# EAGLE design Triggy 0.3 (EAGLE 7.4.0)
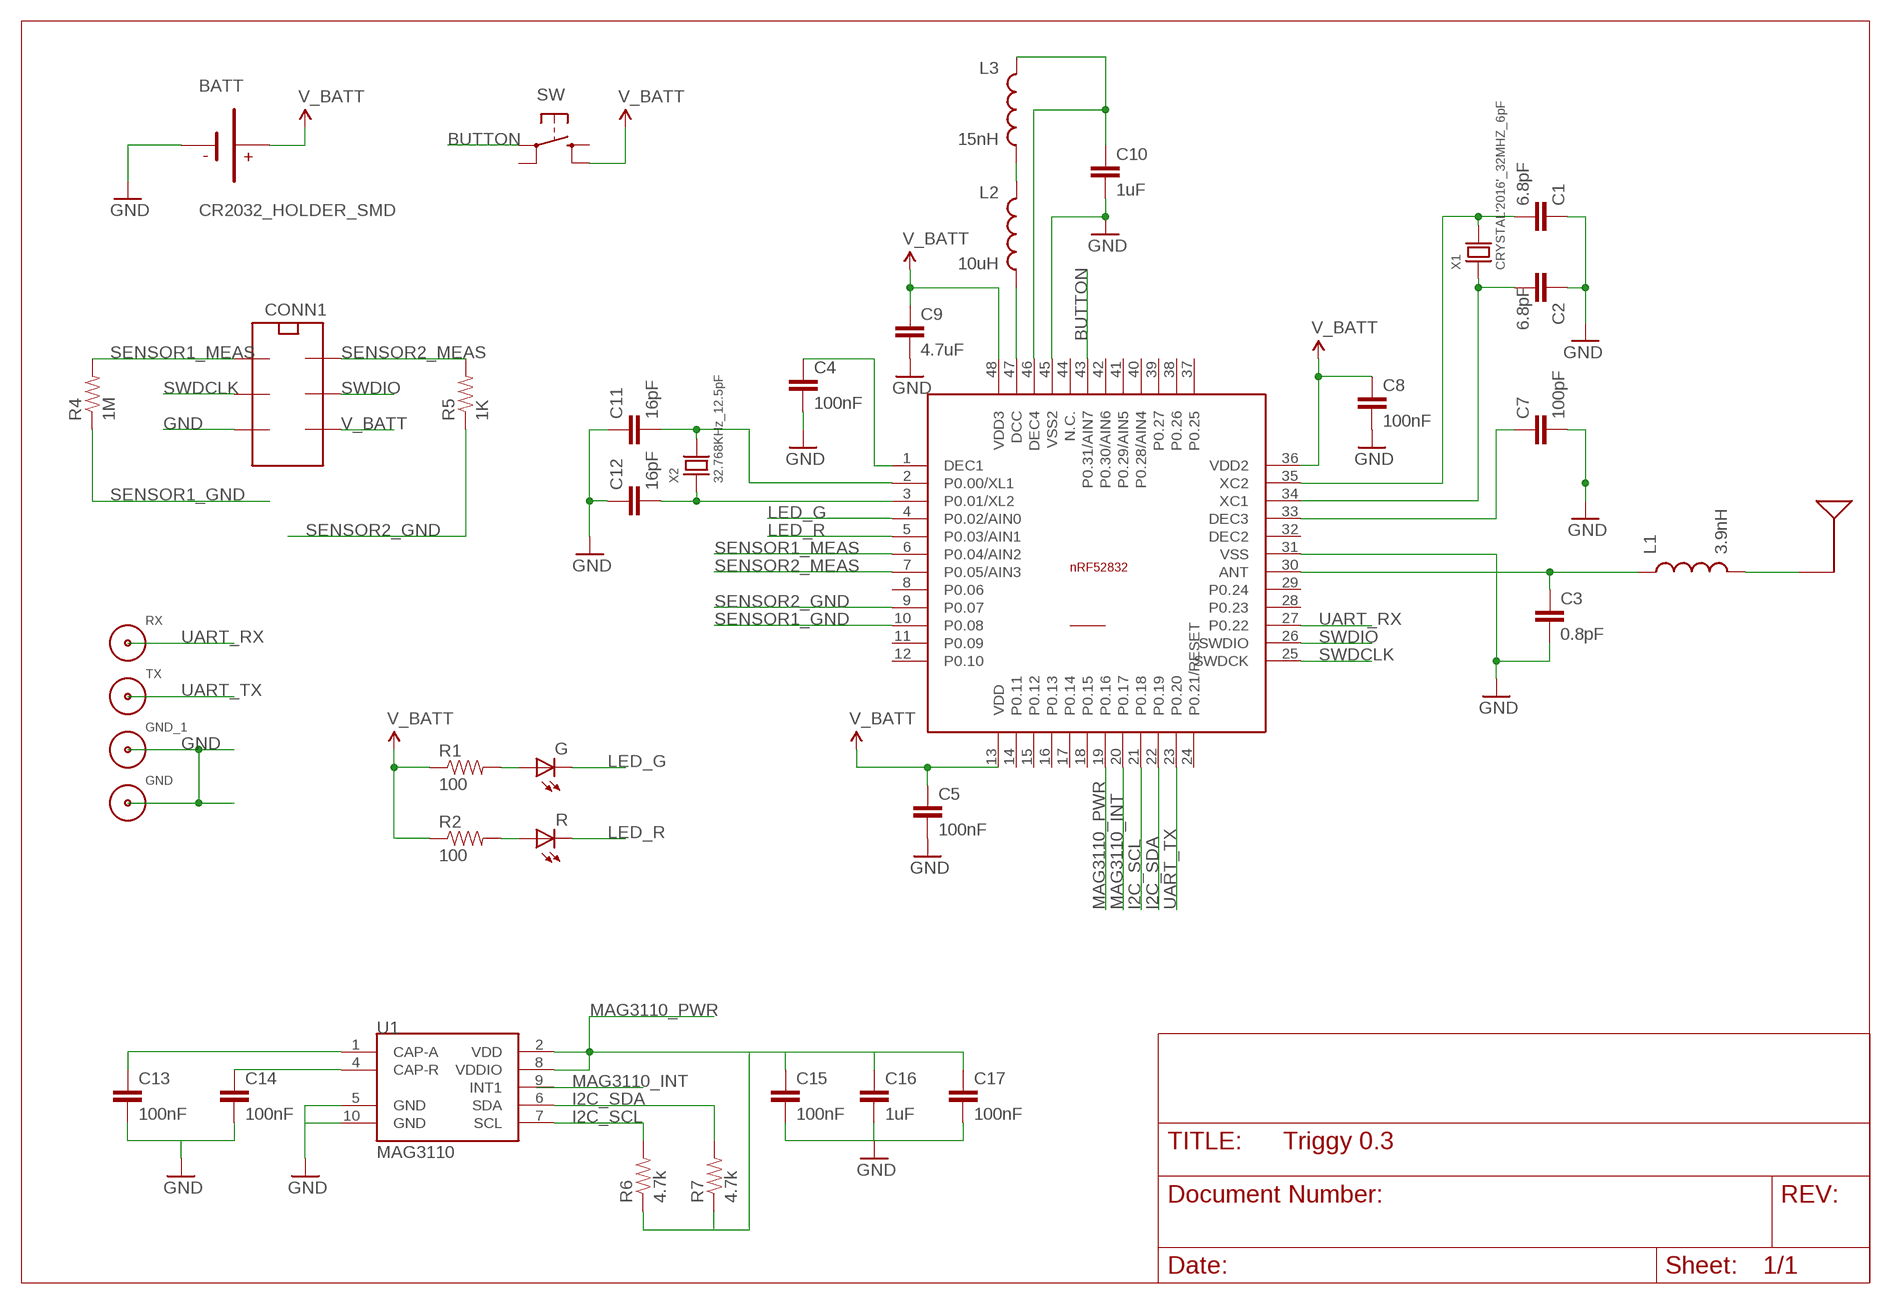
[diagram p0: schematic, sheet 1]

## Parts
ANT  ANTENNA_2450AT43A100  [ANTENNA-SMD-7MM]
BATT  CR2032_HOLDER_SMD  [CR2032_HOLDER_SMD]
C1  6.8pF  CAP0402-CAP  [0402-CAP]
C2  6.8pF  CAP0402-CAP  [0402-CAP]
C3  0.8pF  CAP0402-CAP  [0402-CAP]
C4  100nF  CAP0402-CAP  [0402-CAP]
C5  100nF  CAP0402-CAP  [0402-CAP]
C7  100pF  CAP0402-CAP  [0402-CAP]
C8  100nF  CAP0402-CAP  [0402-CAP]
C9  4.7uF  CAP0603-CAP  [0603-CAP]
C10  1uF  CAP0603-CAP  [0603-CAP]
C11  16pF  CAP0402-CAP  [0402-CAP]
C12  16pF  CAP0402-CAP  [0402-CAP]
C13  100nF  CAP0402-CAP  [0402-CAP]
C14  100nF  CAP0402-CAP  [0402-CAP]
C15  100nF  CAP0402-CAP  [0402-CAP]
C16  1uF  CAP0603-CAP  [0603-CAP]
C17  100nF  CAP0402-CAP  [0402-CAP]
CONN1  MOLEX_8734006XX  [MOLEX_8734006XX]
GND  SINGLE_CONN  [SINGLE-CONN]
GND_1  SINGLE_CONN  [SINGLE-CONN]
L1  3.9nH  INDUCTOR0402  [C0402]
L2  10uH  INDUCTOR0603  [0603]
L3  15nH  INDUCTOR0402  [C0402]
LEDS  LED-R-G  [LED-RG-SMD-3X2.5MM]
NRF52832  NRF52832_QFN  [QFN48]
R1  100  RESISTOR0402  [0402-RES]
R2  100  RESISTOR0402  [0402-RES]
R4  1M  RESISTOR0402  [0402-RES]
R5  1K  RESISTOR0402  [0402-RES]
R6  4.7k  RESISTOR0402  [0402-RES]
R7  4.7k  RESISTOR0402  [0402-RES]
RX  SINGLE_CONN  [SINGLE-CONN]
SW  SWITCH-PANASONIC  [SWITCH-PANASONIC]
TX  SINGLE_CONN  [SINGLE-CONN]
U1  MAG3110  [DFN-10]
X1  CRYSTAL'2016'_32MHZ_6pF  CRYSTAL'2016'_32MHZ  [X4-SMD-2.0X1.6MM]
X2  32.768KHz_12.5pF  CRYSTAL'3215'  [X2-SMD-3.2X1.5MM]

## Nets
BUTTON: NRF52832.43(P0.31/AIN7) SW.A
GND: BATT.- C1.1 C2.1 C3.2 C4.2 C5.2 C7.2 C8.2 C9.2 C10.2 C11.1 C12.1 C13.2 C14.2 C15.2 C16.2 C17.2 CONN1.P$5 GND.1 GND_1.1 NRF52832.31(VSS) NRF52832.45(VSS2) U1.5(GND) U1.10(GND)
I2C_SCL: NRF52832.21(P0.18) R6.2 U1.7(SCL)
I2C_SDA: NRF52832.22(P0.19) R7.2 U1.6(SDA)
LED_G: LEDS.P$4(P4) NRF52832.4(P0.02/AIN0)
LED_R: LEDS.P$2(P2) NRF52832.5(P0.03/AIN1)
MAG3110_INT: NRF52832.20(P0.17) U1.9(INT1)
MAG3110_PWR: C15.1 C16.1 C17.1 NRF52832.19(P0.16) R6.1 R7.1 U1.2(VDD) U1.8(VDDIO)
N$2: C3.1 L1.1 NRF52832.30(ANT)
N$3: ANT.1 L1.2
N$4: C1.2 NRF52832.35(XC2) X1.4
N$5: C7.1 NRF52832.33(DEC3)
N$6: C4.1 NRF52832.1(DEC1)
N$7: C2.2 NRF52832.34(XC1) X1.2
N$9: L2.1 L3.2
N$10: C12.2 NRF52832.3(P0.01/XL2) X2.P$1
N$11: C11.2 NRF52832.2(P0.00/XL1) X2.P$2
N$12: L2.2 NRF52832.47(DCC)
N$13: C13.1 U1.1(CAP-A)
N$14: C14.1 U1.4(CAP-R)
N$15: C10.1 L3.1 NRF52832.46(DEC4)
N$24: LEDS.P$3(P3) R1.2
N$25: LEDS.P$1(P1) R2.2
SENSOR1_GND: NRF52832.10(P0.08) R4.1
SENSOR1_MEAS: CONN1.P$1 NRF52832.6(P0.04/AIN2) R4.2
SENSOR2_GND: NRF52832.9(P0.07) R5.1
SENSOR2_MEAS: CONN1.P$2 NRF52832.7(P0.05/AIN3) R5.2
SWDCLK: CONN1.P$3 NRF52832.25(SWDCK)
SWDIO: CONN1.P$4 NRF52832.26(SWDIO)
UART_RX: NRF52832.27(P0.22) RX.1
UART_TX: NRF52832.23(P0.20) TX.1
V_BATT: BATT.+ BATT.+@(+) C5.1 C8.1 C9.1 CONN1.P$6 NRF52832.13(VDD) NRF52832.36(VDD2) NRF52832.48(VDD3) R1.1 R2.1 SW.B'
Unconnected: NRF52832.8(P0.06) NRF52832.11(P0.09) NRF52832.12(P0.10) NRF52832.14(P0.11) NRF52832.15(P0.12) NRF52832.16(P0.13) NRF52832.17(P0.14) NRF52832.18(P0.15) NRF52832.24(P0.21/RESET) NRF52832.28(P0.23) NRF52832.29(P0.24) NRF52832.37(P0.25) NRF52832.38(P0.26) NRF52832.39(P0.27) NRF52832.40(P0.28/AIN4) NRF52832.41(P0.29/AIN5) NRF52832.42(P0.30/AIN6) NRF52832.44(N.C.) NRF52832.GND(SLUG) SW.A' SW.B

## Power pins joined to a net without a drawn wire
DEC2: NRF52832.32(DEC2)

## Library data of the parts
ANT = Triggy:ANTENNA_2450AT43A100
BATT = Watchee:CR2032_HOLDER_SMD
C1-C5 C7-C17 = SparkFun-Capacitors:CAP: Capacitor Standard 0603 ceramic capacitor, and 0.1" leaded capacitor.
CONN1 = Triggy:MOLEX_8734006XX
GND GND_1 RX TX = Watchee:SINGLE_CONN
L1-L3 = SparkFun-Passives:INDUCTOR: Inductors Basic Inductor/Choke - 0603 and 1206. Footprints are not proven and vary greatly between part numbers. INDUCTOR POWER 3.3UH 4.0A SMD 0.197" L x 0.197" W x 0.177" H (5.00mm x 5.00mm x 4.50mm)
LEDS = Watchee:LED-R-G
NRF52832 = NordicSemi:NRF52832_QFN
R1 R2 R4-R7 = SparkFun-Resistors:RESISTOR: Resistor Basic schematic elements and footprints for 0603, 1206, and PTH resistors.
SW = Triggy:SWITCH-PANASONIC
U1 = SparkFun-Sensors:MAG3110: 3-axis digital (I2C) magnetometer
X1 = Triggy:CRYSTAL'2016'_32MHZ
X2 = Watchee:CRYSTAL'3215'

## Board
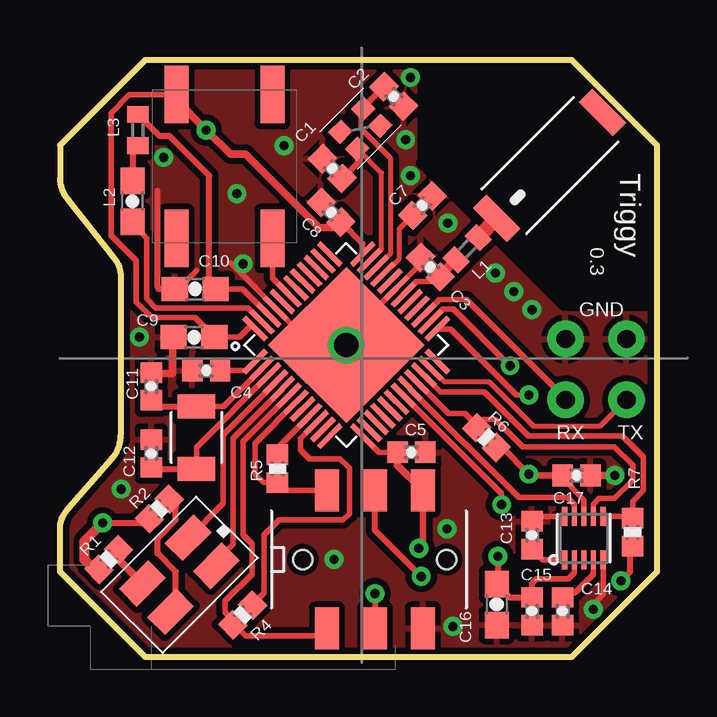
[diagram p1: board, top side]
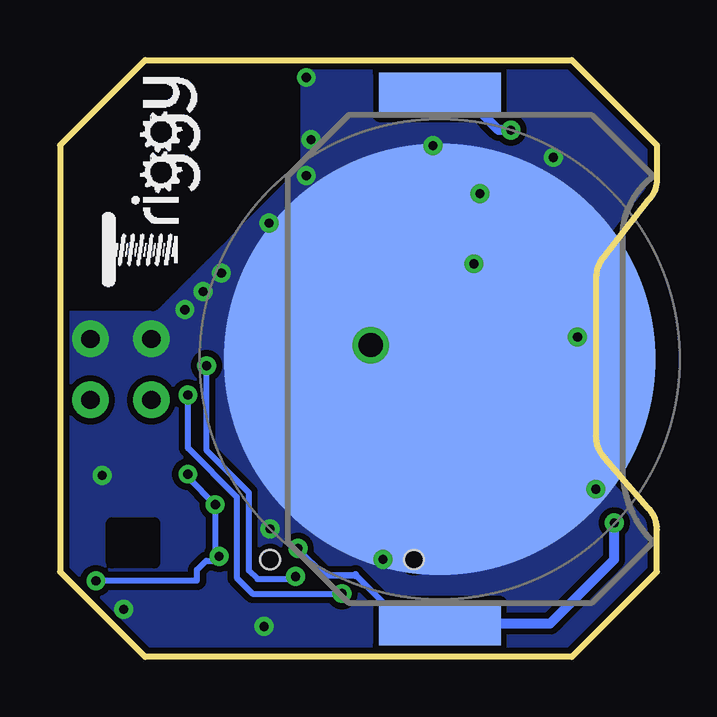
[diagram p2: board, bottom side, seen from below]

Size 24.89 x 24.89 mm. Coordinates in mm from the lower left corner, seen from the top.
Outline: 24.89,21.34 24.89,3.56 21.34,0 3.56,0 0,3.56 0,5.32 arc-45 0.37,6.21 2.15,8.26 arc45 2.54,9.26 2.54,15.83 arc45 2.17,16.73 0.37,19.03 arc-45 0,19.93 0,21.34 3.56,24.89 21.34,24.89 24.89,21.34
Copper layers (1*16): Top 0.035mm / dielectric 1mm / Bottom 0.035mm
Design rules "My Rules": minimum track width 6mil, minimum drill 8mil, track to track 6mil, track to pad 6mil, pad to pad 6mil, via to via 8mil, smd to smd 6mil, copper to edge 8mil, drill to drill 8mil, minimum pad ring 8mil, minimum via ring 8mil, stop-mask expansion 4mil, vias tented up to drill 20mil, thermal gap 10mil
tRestrict: area 15.1,20.6 to 24.8,24.6; area 21.2,14.7 to 25.2,24.3; area 15.1,14.7 to 27.8,27.4; area 5.1,7.9 to 6.2,10.4; area 5.2,15.1 to 6.1,15.5; area 20.7,3.9 to 22.9,5.8; 1 lines
bRestrict: area 21.2,14.7 to 25.2,24.3; area 15.1,20.6 to 24.8,24.6; area 15.1,14.7 to 27.8,27.4; area 21,3.9 to 22.7,5.6

### Footprints (pad centres in the part's own frame; a part is rotated, then mirrored left to right if it is on the bottom)
ANTENNA-SMD-7MM = smd 0.8 x 2: 1 -3.125,0; 2 3.125,0
CR2032_HOLDER_SMD = smd 1.8 x 5.08: + -11.03,0; +@ 11.03,0 | smd 18 x 18: - 0,0
0402-CAP = smd 0.85 x 0.9: 1 -0.58,0; 2 0.58,0
0603-CAP = smd 1.1 x 1: 1 -0.85,0; 2 0.85,0
MOLEX_8734006XX = smd 1 x 1.75: P$1 -2,-2.875; P$2 -2,2.875; P$3 0,-2.875; P$4 0,2.875; P$5 2,-2.875; P$6 2,2.875 | hole 0.8: -3,0; 3,0
SINGLE-CONN = drill 0.762 pad 1.524: 1 0,0
C0402 = smd 0.7 x 0.9: 1 -0.65,0; 2 0.65,0
0603 = smd 1.1 x 1: 1 -0.85,0; 2 0.85,0
LED-RG-SMD-3X2.5MM = smd 1.7 x 1.05: P$1 1.35,0.83; P$2 -1.35,0.83; P$3 1.35,-0.83; P$4 -1.35,-0.83
QFN48 = smd 1.3 x 0.226: 1 -3.17,2.2; 2 -3.17,1.8; 3 -3.17,1.4; 4 -3.17,1; 5 -3.17,0.6; 6 -3.17,0.2; 7 -3.17,-0.2; 8 -3.17,-0.6; 9 -3.17,-1; 10 -3.17,-1.4; 11 -3.17,-1.8; 12 -3.17,-2.2; 25 3.17,-2.2; 26 3.17,-1.8; 27 3.17,-1.4; 28 3.17,-1; 29 3.17,-0.6; 30 3.17,-0.2; 31 3.17,0.2; 32 3.17,0.6; 33 3.17,1; 34 3.17,1.4; 35 3.17,1.8; 36 3.17,2.2 | smd 0.226 x 1.3: 13 -2.2,-3.17; 14 -1.8,-3.17; 15 -1.4,-3.17; 16 -1,-3.17; 17 -0.6,-3.17; 18 -0.2,-3.17; 19 0.2,-3.17; 20 0.6,-3.17; 21 1,-3.17; 22 1.4,-3.17; 23 1.8,-3.17; 24 2.2,-3.17; 37 2.2,3.17; 38 1.8,3.17; 39 1.4,3.17; 40 1,3.17; 41 0.6,3.17; 42 0.2,3.17; 43 -0.2,3.17; 44 -0.6,3.17; 45 -1,3.17; 46 -1.4,3.17; 47 -1.8,3.17; 48 -2.2,3.17 | smd 4.6 x 4.6: GND 0,0
0402-RES = smd 0.85 x 0.9: 1 -0.58,0; 2 0.58,0
SWITCH-PANASONIC = smd 2.4 x 1: A -3,-2; A' 3,-2; B -3,2; B' 3,2
DFN-10 = smd 0.8 x 0.22: 1 -0.91,0.8; 2 -0.91,0.4; 3 -0.91,0; 4 -0.91,-0.4; 5 -0.91,-0.8; 6 0.91,-0.8; 7 0.91,-0.4; 8 0.91,0; 9 0.91,0.4; 10 0.91,0.8
X4-SMD-2.0X1.6MM = smd 0.75 x 0.7: 1 -0.675,0.5; 2 -0.675,-0.5; 3 0.675,-0.5; 4 0.675,0.5
X2-SMD-3.2X1.5MM = smd 1 x 1.55: P$1 -1.3,0; P$2 1.3,0

### Placement (x,y rotation side)
ANT  20.42,20.5 45 top
BATT  9.05,12.42 90 bottom
C1  11.35,20.37 315 top
C2  13.92,23.37 135 top
C3  15.44,16.26 135 top
C4  6.1,11.94 180 top
C5  14.66,8.53 0 top
C7  15.11,18.82 45 top
C8  11.3,18.54 135 top
C9  5.59,13.34 180 top
C10  5.64,15.34 180 top
C11  3.81,11.28 270 top
C12  3.81,8.48 270 top
C13  19.68,5.08 90 top
C14  20.95,1.91 270 top
C15  19.68,1.91 270 top
C16  18.21,2.18 270 top
C17  21.54,7.57 0 top
CONN1  13.13,4.06 0 top
GND  21.08,13.26 0 top
GND_1  23.62,13.26 0 top
L1  16.98,17.02 45 top
L2  3.02,19 270 top
L3  3.25,21.97 270 top
LEDS  4.98,3.43 225 top
NRF52832  11.94,13 45 top
R1  2.03,4.06 45 top
R2  4.14,6.17 45 top
R4  7.62,1.75 225 top
R5  9.07,7.85 270 top
R6  17.78,9.14 135 top
R7  23.88,5.21 90 top
RX  21.08,10.72 90 top
SW  6.86,20.45 90 top
TX  23.62,10.72 90 top
U1  21.84,4.95 90 top
X1  12.52,22.02 225 top
X2  5.69,9.14 90 top

### Tracks (layer width: path | path; a pad name or v marks a point on that pad's centre or on a via)
BUTTON
  Top 0.229: NRF52832.43 8.86,15.8 SW.A
GND  (via drill 0.38, 1.02)
  Top 0.203: NRF52832.45 10.36,13.16 11.79,13.16 v11.94,13.01 12.55,13.61 12.57,13.92 | NRF52832.31 15.27,16.61 | NRF52832.45 8.99,14.56 7.32,16.23 | NRF52832.45 7.09,16.43 | C10.2 4.93,15.34 5.71,16.13
  Top 0.229: 12.57,13.92 NRF52832.31 | U1.10 19.89,5.86 C13.2 | U1.5 22.66,4.03 22.66,2.62 22.04,2 22.04,1.86
  Top 0.254: 4.06,19.43 4.06,15.44 4.17,15.34 C10.2
  Top 0.305: 3.81,11.81 4.7,11.81 4.7,13.34 | C17.2 23.05,7.57
  Bottom 0.254: 4.83,19.43 4.95,19.43
  other vias: 11.43,4.06 2.55,7 18.16,16 18.92,15.24 14.62,20.07 14.62,24.16 19.68,14.48 16.17,18.09 14.42,21.57 4.32,20.83 9.34,21.32 3.31,13.35 7.63,16.39 7.38,19.32 23.13,7.58 22.24,1.99 16.13,5.33 16.38,1.27
  pour Bottom (isolate 0.254, no thermals): 0,24.9 24.89,24.89 24.9,17.5 24.89,0 0,0 0,5.59 2.51,8.81 2.59,16.08 0,19.15
  pour Top (isolate 0.254): 0,24.91 24.89,24.89 24.89,0.01 0,0 0,5.59 2.51,8.86 2.51,16.18 0,19.15
I2C_SCL
  Top 0.229: U1.7 22.24,6.37 22.48,6.6 23.11,6.6 23.88,7.37 23.88,8 23.11,8.76 19.3,8.76 18.16,9.91 17.65,9.91 17.37,9.62 R6.2 17.37,9.68 16.89,10.16 16.2,10.16 NRF52832.21
I2C_SDA
  Top 0.229: R7.2 23.8,5.86 U1.6 23.64,5.86 23.75,5.97 | NRF52832.22 15.87,11.05 17.7,11.05 19.53,9.22 23.44,9.22 24.33,8.33 24.33,6.93 23.88,6.48 R7.2 | 24.13,6.04 R7.2
LED_G
  Top 0.229: NRF52832.4 8.99,11.45 6.78,9.25 6.81,9.22 6.81,6.4 5.38,4.97 LEDS.P$4
LED_R
  Top 0.229: NRF52832.5 9.27,11.18 7.21,9.12 7.21,4.7 6.52,4 LEDS.P$2
MAG3110_INT
  Top 0.229: U1.9 21.44,6.37 21.16,6.66 19.13,6.66 14.6,11.18 NRF52832.20
MAG3110_PWR  (via drill 0.38)
  Top 0.229: U1.8 21.84,6.55 20.96,7.44 C17.1 | NRF52832.19 18.41,6.81 v18.41,6.35 | U1.2 21.44,3.5 21.2,3.25 19.86,3.25 19.68,3.07 C15.1
  Top 0.254: v19.56,7.62 19.61,7.57 | 18.44,8.73 R6.1 | v23.39,3.17 23.77,3.56 23.77,4.53 R7.1 | 18.16,3.03 C16.1 | C16.1 18.76,2.48 C15.1 | v18.26,4.19 18.26,3.08 C16.1
  Top 0.279: 19.61,7.57 C17.1 | v19.56,7.62 18.44,8.73
  Bottom 0.254: 19.56,7.49 v19.56,7.62 | v23.39,3.17 19.18,3.17 19.18,3.63 18.8,4.01 18.44,4.01 v18.26,4.19 18.41,4.34 v18.41,6.35
  Bottom 0.279: v18.41,6.35 19.56,7.49
N$2
  Top 0.229: NRF52832.30 14.86,15.65 15.65,15.65 C3.1
  Top 0.406: C3.1 15.85,15.89 L1.1
N$3
  Top 0.61: L1.2 17.44,17.52 ANT.1
N$4
  Top 0.203: NRF52832.35 13.41,17.02 13.41,20.18 X1.4
  Top 0.254: X1.4 12.4,20.59 C1.2
N$5
  Top 0.203: NRF52832.33 13.47,15.96 13.5,15.96 14.15,16.61 14.15,17.86 C7.1
N$6
  Top 0.229: C4.1 7.76,11.94 NRF52832.1
N$7
  Top 0.203: 12.57,22.78 X1.2 12.55,22.75 12.55,22.02 13.79,20.78 13.79,16.84 13.64,16.69 NRF52832.34
  Top 0.254: X1.2 12.65,22.91 C2.2
  Top 0.305: C2.2 13.51,23.72
N$9
  Top 0.254: L3.2 3.02,21.09 L2.1
N$10
  Top 0.229: NRF52832.3 5.69,8.74 X2.P$1
  Top 0.254: 5.5,7.65 X2.P$1 3.87,7.84 C12.2
N$11
  Top 0.229: NRF52832.2 6.83,10.44 X2.P$2
  Top 0.254: 5.44,10.7 X2.P$2 4.06,10.44 C11.2
N$12
  Top 0.229: L2.2 3.02,18.06 3.61,17.48 3.61,14.94 3.99,14.55 7.84,14.55 NRF52832.47
N$13
  Top 0.229: U1.1 20.14,4.04 C13.1
N$14
  Top 0.229: U1.4 22.24,3.45 21.46,2.67 21.14,2.67 C14.1
N$15
  Top 0.229: NRF52832.46 7.62,15.34 C10.1
  Top 0.254: 3.29,22.62 L3.1 4.16,21.72 4.57,21.72 6.22,20.07 6.22,15.56 6.44,15.34 C10.1
N$24
  Top 0.305: LEDS.P$3 2.31,4.18 2.31,4.35 R1.2
N$25
  Top 0.254: LEDS.P$1 4.83,2.1 4.83,3.56 4.06,4.32 4.06,4.95 4.83,5.71 4.83,6.22 | 4.83,6.22 4.45,6.6 | R2.2 4.83,6.31 4.83,6.22
SENSOR1_GND
  Top 0.229: NRF52832.10 10.03,9.12 10.03,8.64 10.41,8.26 11.68,8.26 12.06,7.87 12.06,5.97 11.81,5.71 9.14,5.71 8.51,5.08 8.51,2.67 8.03,2.19 R4.1
SENSOR1_MEAS
  Top 0.229: NRF52832.6 7.64,8.99 7.64,5.08 8,4.72 8,3.45 6.88,2.34 6.88,1.85 7.21,1.53 R4.2 7.29,1.34 7.75,0.89 10.83,0.89 CONN1.P$1
SENSOR2_GND
  Top 0.229: NRF52832.9 9.07,8.72 R5.1
SENSOR2_MEAS
  Top 0.229: NRF52832.7 8.13,8.91 8.13,7.62 8.48,7.27 R5.2 9.4,6.94 CONN1.P$2
SWDCLK  (via drill 0.38)
  Top 0.229: CONN1.P$3 13.08,1.14 | v19.56,10.92 19.02,10.92 16.28,13.66 15.76,13.66 NRF52832.25
  Top 0.254: v13.13,2.64 CONN1.P$3 | CONN1.P$3 13.13,0.69 12.95,0.51 12.95,1.01 CONN1.P$3
  Bottom 0.254: v13.13,2.64 16.87,2.64 17.53,3.3 17.53,6.68 19.56,8.71 v19.56,10.92
SWDIO  (via drill 0.38)
  Top 0.229: NRF52832.26 15.98,14.5 16.41,14.5 v18.77,12.14
  Top 0.254: CONN1.P$4 13.13,5.28 v15.06,3.35
  Bottom 0.254: v18.77,12.14 18.8,12.12 18.8,8.64 17.02,6.86 17.02,3.61 16.66,3.25 15.16,3.25 v15.06,3.35
UART_RX
  Top 0.229: NRF52832.27 15.82,14.91 16.94,14.91 21.08,10.77 RX.1
UART_TX
  Top 0.203: TX.1 22.53,9.63 19.74,9.63 17.88,11.48 16.03,11.48 15.47,12.04 NRF52832.23
V_BATT  (via drill 0.38)
  Top 0.229: NRF52832.48 7.99,13.84 7.48,13.34 C9.1 5.62,14.15 3.83,14.15 3.17,14.81 3.17,16.54 2.13,17.58 2.13,22.68 2.9,23.44 SW.B' | NRF52832.13 13.3,8.53 C5.1
  Top 0.254: NRF52832.36 12.62,17.22 C8.1 | v1.78,5.59 3.56,5.59 R2.1
  Top 0.279: CONN1.P$6 15.13,4.69 v14.96,4.52
  Top 0.305: 5.08,24.13 5.08,23.67 SW.B' 4.86,23.21 v6.1,21.97 7.11,20.95 7.75,20.95 10.79,17.91 11.49,17.91 C8.1 11.62,18.03 | CONN1.P$6 14.08,8 C5.1
  Top 0.406: v1.78,5.59 1.02,4.83 1.02,4.06 1.45,3.63 1.6,3.63 R1.1
  Bottom 0.254: 9.5,22.68 9.65,22.84 BATT.+@
  Bottom 0.279: 9.66,1.4 10.42,2.16 11.3,2.16 12.57,3.43 | v14.96,4.52 14.96,4.5 13.87,3.4 12.6,3.4
  Bottom 0.305: 7.49,22.86 7.49,23.11 7.24,23.37 | 12.6,3.4 12.57,3.43
  Bottom 0.406: BATT.+ 9.66,1.4 4.45,1.4 1.78,4.06 v1.78,5.59 | BATT.+@ 8.13,23.45 | 8.13,23.45 7.96,23.45 | 7.24,23.37 7.49,23.62 7.96,23.62 8.13,23.45 | v6.1,21.97 6.6,21.97 7.49,22.86

### Text on the board
tPlace: Triggy | 0.3
200bmp: D:/Mes Documents/Watchee 0.1 Board/logo_pcb_small.bmp